# Altium schematic sheet MINI-PCIE.SchDoc
size A4
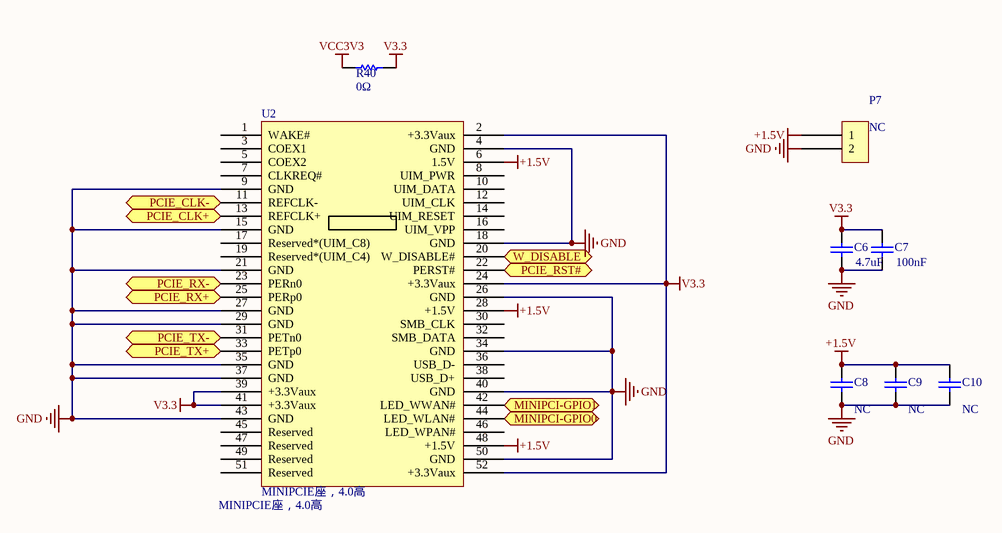
[diagram p0: MINI-PCIE.SchDoc]

## Parts
C6  4.7uF  [C0603N]
C7  100nF  [0402]
C8  NC  [C0603N]
C9  NC  [0402]
C10  NC  [0402]
P7  NC  [HDR1X2]
R40  0Ω  [R0805N]
U2  MINIPCIE座，4.0高  [MINIPCIE]

## Ports
MINIPCI-GPIO0, MINIPCI-GPIO1, PCIE_CLK+, PCIE_CLK-, PCIE_RST#, PCIE_RX+, PCIE_RX-, PCIE_TX+, PCIE_TX-, W_DISABLE

## Nets
+1.5V: C8.2 C9.2 C10.2 P7.1 U2.6(1.5V) U2.28(+1.5V) U2.48(+1.5V)
GND: C6.1 C7.1 C8.1 C9.1 C10.1 P7.2 U2.4(GND) U2.9(GND) U2.15(GND) U2.18(GND) U2.21(GND) U2.26(GND) U2.27(GND) U2.29(GND) U2.34(GND) U2.35(GND) U2.37(GND) U2.40(GND) U2.43(GND) U2.50(GND)
V3.3: C6.2 C7.2 R40.1 U2.2(+3.3Vaux) U2.24(+3.3Vaux) U2.39(+3.3Vaux) U2.41(+3.3Vaux) U2.52(+3.3Vaux)
VCC3V3: R40.2
MINIPCI-GPIO0: U2.44(LED_WLAN#) ; port MINIPCI-GPIO0
MINIPCI-GPIO1: U2.42(LED_WWAN#) ; port MINIPCI-GPIO1
PCIE_CLK+: U2.13(REFCLK+) ; port PCIE_CLK+
PCIE_CLK-: U2.11(REFCLK-) ; port PCIE_CLK-
PCIE_RST#: U2.22(PERST#) ; port PCIE_RST#
PCIE_RX+: U2.25(PERp0) ; port PCIE_RX+
PCIE_RX-: U2.23(PERn0) ; port PCIE_RX-
PCIE_TX+: U2.33(PETp0) ; port PCIE_TX+
PCIE_TX-: U2.31(PETn0) ; port PCIE_TX-
W_DISABLE: U2.20(W_DISABLE#) ; port W_DISABLE

Not connected (* = marked no-connect by the designer): U2 1(WAKE#) 3(COEX1) 5(COEX2) 7(CLKREQ#) 8(UIM_PWR) 10(UIM_DATA) 12(UIM_CLK) 14(UIM_RESET) 16(UIM_VPP) 17(Reserved*(UIM_C8)) 19(Reserved*(UIM_C4)) 30(SMB_CLK) 32(SMB_DATA) 36(USB_D-) 38(USB_D+) 45(Reserved) 46(LED_WPAN#) 47(Reserved) 49(Reserved) 51(Reserved)

## Library data of the parts
C6-C10 = Cap: Capacitor; Published: 8-Jun-2000; LatestRevisionDate: 17-Jul-2002; LatestRevisionNote: Re-released for DXP Platform.; PackageReference: RAD-0.3; Publisher: Altium Limited
  C6: Value: 4.7uF
  C7: Value: 100nF
  C8-C10: Value: NC
P7 = Head2: Value: NC
R40 = Res Semi: Semiconductor Resistor; Published: 8-Jun-2000; LatestRevisionDate: 17-Jul-2002; LatestRevisionNote: Re-released for DXP Platform.; PackageReference: AXIAL-0.5; Publisher: Altium Limited; Value: 0Ω
U2 = PCI-E MINI CARD CONNECTOR: Value: MINIPCIE座，4.0高